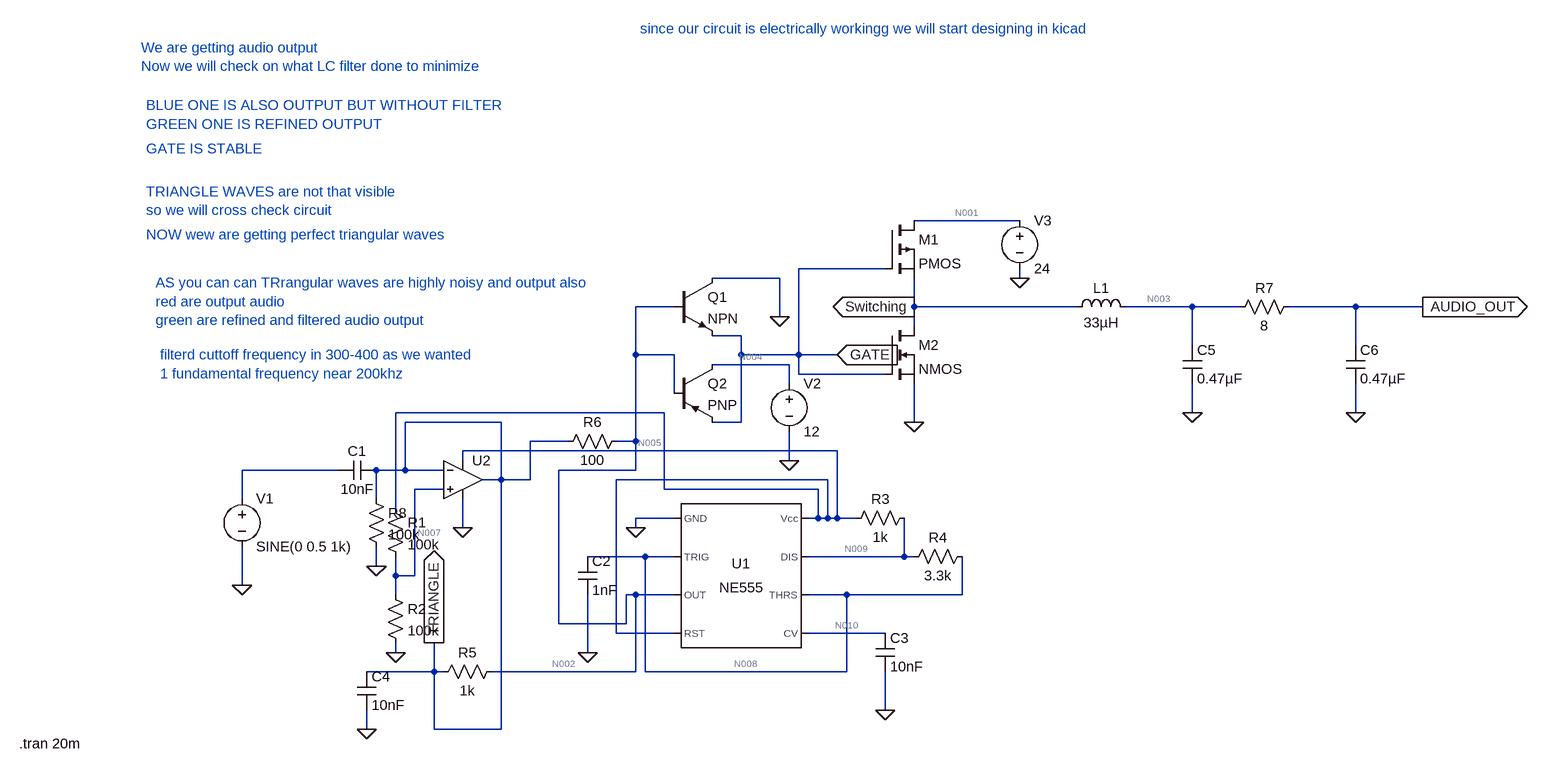
[diagram p0: schematic CLASS D.asc]
CLASS D.asc, the LTspice schematic file:
Version 4.1
SHEET 1 2508 680
WIRE 736 -368 560 -368
WIRE 512 -288 368 -288
WIRE 336 -272 224 -272
WIRE 736 -272 736 -288
WIRE 160 -224 96 -224
WIRE 560 -224 560 -272
WIRE 832 -224 560 -224
WIRE 1024 -224 912 -224
WIRE 1104 -224 1024 -224
WIRE 1296 -224 1184 -224
WIRE 1408 -224 1296 -224
WIRE 336 -208 336 -272
WIRE 560 -192 560 -224
WIRE 272 -176 224 -176
WIRE 1024 -160 1024 -224
WIRE 1296 -160 1296 -224
WIRE 96 -144 96 -224
WIRE 160 -144 96 -144
WIRE 272 -144 272 -176
WIRE 368 -144 368 -288
WIRE 368 -144 272 -144
WIRE 432 -144 368 -144
WIRE 352 -128 224 -128
WIRE 368 -112 368 -144
WIRE 512 -112 368 -112
WIRE 352 -96 352 -128
WIRE 160 -80 160 -144
WIRE 144 -48 -304 -48
WIRE 1024 -48 1024 -96
WIRE 1296 -48 1296 -96
WIRE -128 -32 -288 -32
WIRE 272 -32 272 -144
WIRE 272 -32 224 -32
WIRE 560 -32 560 -96
WIRE -16 0 -80 0
WIRE 96 0 96 -144
WIRE 96 0 64 0
WIRE 432 16 -192 16
WIRE -192 32 -192 16
WIRE 352 32 352 -16
WIRE -400 48 -560 48
WIRE -288 48 -288 -32
WIRE -288 48 -336 48
WIRE -224 48 -288 48
WIRE 96 48 96 0
WIRE 96 48 -32 48
WIRE -128 64 -128 -32
WIRE -128 64 -160 64
WIRE -80 64 -80 0
WIRE -80 64 -128 64
WIRE 416 64 64 64
WIRE -224 80 -272 80
WIRE 144 80 144 -48
WIRE 400 80 144 80
WIRE -560 96 -560 48
WIRE -336 96 -336 48
WIRE -304 112 -304 -48
WIRE 160 128 96 128
WIRE 400 128 400 80
WIRE 400 128 384 128
WIRE 416 128 416 64
WIRE 416 128 400 128
WIRE 432 128 432 16
WIRE 432 128 416 128
WIRE 464 128 432 128
WIRE -192 144 -192 96
WIRE 96 144 96 128
WIRE 112 192 16 192
WIRE 160 192 112 192
WIRE 544 192 544 128
WIRE 544 192 384 192
WIRE 560 192 544 192
WIRE -336 208 -336 176
WIRE -304 224 -304 192
WIRE -272 224 -272 80
WIRE -272 224 -304 224
WIRE -560 240 -560 176
WIRE -304 256 -304 224
WIRE 96 256 80 256
WIRE 160 256 96 256
WIRE 448 256 384 256
WIRE 640 256 640 192
WIRE 640 256 448 256
WIRE -32 304 -32 48
WIRE 80 304 80 256
WIRE 80 304 -32 304
WIRE 64 320 64 64
WIRE 160 320 64 320
WIRE 512 320 384 320
WIRE -304 352 -304 336
WIRE 16 352 16 256
WIRE -240 384 -240 336
WIRE -240 384 -352 384
WIRE -224 384 -240 384
WIRE 96 384 96 256
WIRE 96 384 -144 384
WIRE 112 384 112 192
WIRE 448 384 448 256
WIRE 448 384 112 384
WIRE 512 448 512 384
WIRE -352 480 -352 448
WIRE -240 480 -240 384
WIRE -128 480 -128 64
WIRE -128 480 -240 480
FLAG -560 240 0
FLAG -304 352 0
FLAG 16 352 0
FLAG 512 448 0
FLAG 96 144 0
FLAG -192 144 0
FLAG -352 480 0
FLAG -240 336 TRIANGLE
IOPIN -240 336 Out
FLAG 336 -208 0
FLAG 352 32 0
FLAG 560 -32 0
FLAG 736 -272 0
FLAG 432 -144 GATE
IOPIN 432 -144 In
FLAG 560 -224 Switching
IOPIN 560 -224 Out
FLAG 1024 -48 0
FLAG 1296 -48 0
FLAG 1408 -224 AUDIO_OUT
IOPIN 1408 -224 Out
FLAG -336 208 0
SYMBOL Misc\\NE555 272 224 R0
SYMATTR InstName U1
SYMBOL OpAmps\\UniversalOpAmp2 -192 64 R0
SYMATTR InstName U2
SYMBOL cap -336 32 R90
WINDOW 0 0 32 VBottom 2
WINDOW 3 32 32 VTop 2
SYMATTR InstName C1
SYMATTR Value 10nF
SYMBOL voltage -560 80 R0
SYMATTR InstName V1
SYMATTR Value SINE(0 0.5 1k)
SYMBOL res -320 96 R0
SYMATTR InstName R1
SYMATTR Value 100k
SYMBOL res -320 240 R0
SYMATTR InstName R2
SYMATTR Value 100k
SYMBOL res 560 112 R90
WINDOW 0 0 56 VBottom 2
WINDOW 3 32 56 VTop 2
SYMATTR InstName R3
SYMATTR Value 1k
SYMBOL res 656 176 R90
WINDOW 0 0 56 VBottom 2
WINDOW 3 32 56 VTop 2
SYMATTR InstName R4
SYMATTR Value 3.3k
SYMBOL cap 0 192 R0
SYMATTR InstName C2
SYMATTR Value 1nF
SYMBOL cap 496 320 R0
SYMATTR InstName C3
SYMATTR Value 10nF
SYMBOL res -128 368 R90
WINDOW 0 0 56 VBottom 2
WINDOW 3 32 56 VTop 2
SYMATTR InstName R5
SYMATTR Value 1k
SYMBOL cap -368 384 R0
SYMATTR InstName C4
SYMATTR Value 10nF
SYMBOL res 80 -16 R90
WINDOW 0 0 56 VBottom 2
WINDOW 3 32 56 VTop 2
SYMATTR InstName R6
SYMATTR Value 100
SYMBOL npn 160 -272 R0
SYMATTR InstName Q1
SYMBOL pnp 160 -128 R0
SYMATTR InstName Q2
SYMBOL voltage 352 -112 R0
SYMATTR InstName V2
SYMATTR Value 12
SYMBOL pmos 512 -368 R0
SYMATTR InstName M1
SYMBOL nmos 512 -192 R0
SYMATTR InstName M2
SYMBOL voltage 736 -384 R0
SYMATTR InstName V3
SYMATTR Value 24
SYMBOL ind 816 -208 R270
WINDOW 0 32 56 VTop 2
WINDOW 3 5 56 VBottom 2
SYMATTR InstName L1
SYMATTR Value 33µH
SYMATTR SpiceLine Rser=1m
SYMBOL cap 1008 -160 R0
SYMATTR InstName C5
SYMATTR Value 0.47µF
SYMBOL res 1200 -240 R90
WINDOW 0 0 56 VBottom 2
WINDOW 3 32 56 VTop 2
SYMATTR InstName R7
SYMATTR Value 8
SYMBOL cap 1280 -160 R0
SYMATTR InstName C6
SYMATTR Value 0.47µF
SYMBOL res -352 80 R0
SYMATTR InstName R8
SYMATTR Value 100k
TEXT -1808 504 Left 2 !.tran 20m
TEXT -728 -656 Left 2 ;We are getting audio output\nNow we will check on what LC filter done to minimize
TEXT -720 -560 Left 2 ;BLUE ONE IS ALSO OUTPUT BUT WITHOUT FILTER\nGREEN ONE IS REFINED OUTPUT
TEXT -720 -488 Left 2 ;GATE IS STABLE
TEXT -720 -416 Left 2 ;TRIANGLE WAVES are not that visible\nso we will cross check circuit
TEXT -720 -344 Left 2 ;NOW wew are getting perfect triangular waves
TEXT -704 -264 Left 2 ;AS you can can TRrangular waves are highly noisy and output also \nred are output audio\ngreen are refined and filtered audio output
TEXT -696 -144 Left 2 ;filterd cuttoff frequency in 300-400 as we wanted\n1 fundamental frequency near 200khz
TEXT 104 -688 Left 2 ;since our circuit is electrically workingg we will start designing in kicad

The netlist it stands for:
* CLASS D.asc
X§U1 0 N008 N002 N005 N010 N008 N009 N005 NE555  ; pins GND TRIG OUT RST CV THRS DIS Vcc
X§U2 N007 TRIANGLE N005 0 TRIANGLE level2 Avol=1Meg GBW=10Meg Slew=10Meg Ilimit=25m Rail=0 Vos=0 En=0 Enk=0 In=0 Ink=0 Rin=500Meg  ; pins In+ In- V+ V- OUT
C1 TRIANGLE N006 10nF
V1 N006 0 SINE(0 0.5 1k)
R1 N005 N007 100k
R2 N007 0 100k
R3 N009 N005 1k
R4 N008 N009 3.3k
C2 N008 0 1nF
C3 N010 0 10nF
R5 N002 TRIANGLE 1k
C4 TRIANGLE 0 10nF
R6 N002 TRIANGLE 100
Q1 0 N002 GATE 0 NPN
Q2 N004 N002 GATE 0 PNP
V2 N004 0 12
M1 N001 GATE Switching Switching PMOS
M2 Switching GATE 0 0 NMOS
V3 N001 0 24
L1 Switching N003 33µH Rser=1m
C5 N003 0 0.47µF
R7 AUDIO_OUT N003 8
C6 AUDIO_OUT 0 0.47µF
R8 TRIANGLE 0 100k
.model NPN NPN
.model PNP PNP
.lib standard.bjt
.model NMOS NMOS
.model PMOS PMOS
.lib standard.mos
.tran 20m
* We are getting audio output
* Now we will check on what LC filter done to minimize
* BLUE ONE IS ALSO OUTPUT BUT WITHOUT FILTER
* GREEN ONE IS REFINED OUTPUT
* GATE IS STABLE
* TRIANGLE WAVES are not that visible
* so we will cross check circuit
* NOW wew are getting perfect triangular waves
* AS you can can TRrangular waves are highly noisy and output also
* red are output audio
* green are refined and filtered audio output
* filterd cuttoff frequency in 300-400 as we wanted
* 1 fundamental frequency near 200khz
* since our circuit is electrically workingg we will start designing in kicad
.lib NE555.sub
.lib UniversalOpAmp2.lib
.backanno
.end

* Results of the author's LTspice run, read from the files saved beside the schematic
* Operating Point, zero values left out:
*   V(audio_out) = 23.38 V
*   V(gate) = 6.858 V
*   V(n001) = 24 V
*   V(n002) = 6 V
*   V(n003) = 23.38 V
*   V(n004) = 12 V
*   V(n005) = 5.988 V
*   V(n007) = 2.994 V
*   V(n008) = 5.988 V
*   V(n009) = 5.988 V
*   V(n010) = 3.992 V
*   V(switching) = 23.38 V
*   V(triangle) = 3.724 V
*   I(R1) = 29.94 µA
*   I(R2) = 29.94 µA
*   I(R3) = -19.97 nA
*   I(R4) = -11.98 nA
*   I(R5) = 2.276 mA
*   I(R6) = 22.76 mA
*   I(R8) = 37.24 µA
*   I(V2) = -8.906 TA
*   I(V3) = -470.4 µA
*   Ib(M1) = -261.5 µA
*   Ib(M2) = -23.39 pA
*   Ib(Q1) = 4.453 TA
*   Ib(Q2) = -4.453 TA
*   Ic(Q1) = -8.906 TA
*   Ic(Q2) = 8.906 TA
*   Id(M1) = 470.4 µA
*   Id(M2) = 470.4 µA
*   Ie(Q1) = 4.453 TA
*   Ie(Q2) = -4.453 TA
*   Is(M1) = -208.9 µA
*   Is(M2) = -470.4 µA
*   Ix(u1:1) = -1.932 mA
*   Ix(u1:2) = 5.988 nA
*   Ix(u1:3) = 1.962 mA
*   Ix(u1:4) = 29.26 µA
*   Ix(u1:6) = 5.988 nA
*   Ix(u1:7) = 7.99 nA
*   Ix(u1:8) = -59.55 µA
*   Ix(u2:2) = 1.46 nA
*   Ix(u2:3) = 330.5 nA
*   Ix(u2:4) = -25 mA
*   Ix(u2:5) = 25 mA